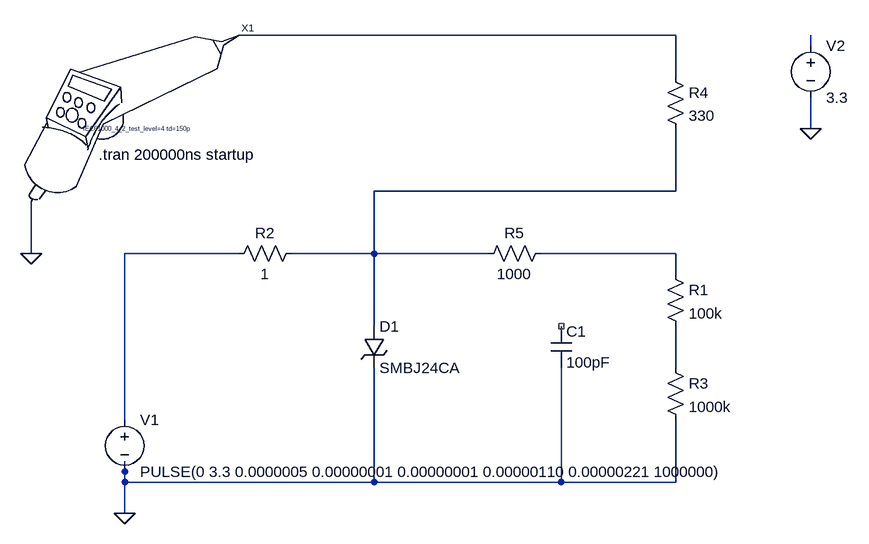
[diagram p0: schematic ESD验证.asc]
ESD验证.asc, the LTspice schematic file:
Version 4.1
SHEET 1 1248 852
WIRE 976 64 304 64
WIRE 1184 80 1184 64
WIRE 976 128 976 64
WIRE 1184 208 1184 160
WIRE 976 304 976 208
WIRE 976 304 512 304
WIRE -16 400 -16 320
WIRE 304 400 128 400
WIRE 512 400 512 304
WIRE 512 400 384 400
WIRE 688 400 512 400
WIRE 976 400 768 400
WIRE 976 432 976 400
WIRE 512 512 512 400
WIRE 976 576 976 512
WIRE 128 656 128 400
WIRE 128 736 128 720
WIRE 128 752 128 736
WIRE 512 752 512 576
WIRE 512 752 128 752
WIRE 800 752 800 576
WIRE 800 752 512 752
WIRE 976 752 976 656
WIRE 976 752 800 752
WIRE 128 800 128 752
FLAG -16 400 0
FLAG 128 800 0
FLAG 1184 208 0
SYMBOL ESD模型\\1818be98-41c7-4d63-a15d-34b865506851\\IEC61000-4-2_ESD_Generator 64 208 R0
WINDOW 39 0 0 Left 0
SYMATTR SpiceLine IEC61000_4_2_test_level=4 td=150p
SYMATTR InstName X1
SYMBOL voltage 128 640 R0
WINDOW 123 0 0 Left 0
WINDOW 39 0 0 Left 0
SYMATTR InstName V1
SYMATTR Value PULSE(0 3.3 0.0000005 0.00000001 0.00000001 0.00000110 0.00000221 1000000)
SYMBOL res 400 384 R90
WINDOW 0 0 56 VBottom 2
WINDOW 3 32 56 VTop 2
SYMATTR InstName R2
SYMATTR Value 1
SYMBOL res 960 560 R0
SYMATTR InstName R3
SYMATTR Value 1000k
SYMBOL res 960 112 R0
SYMATTR InstName R4
SYMATTR Value 330
SYMBOL res 960 416 R0
SYMATTR InstName R1
SYMATTR Value 100k
SYMBOL voltage 1184 64 R0
WINDOW 123 0 0 Left 0
WINDOW 39 0 0 Left 0
SYMATTR InstName V2
SYMATTR Value 3.3
SYMBOL TVSdiode 496 512 R0
WINDOW 0 24 0 Left 2
WINDOW 3 24 64 Left 2
SYMATTR InstName D1
SYMATTR Value SMBJ24CA
SYMATTR Description Diode
SYMATTR Type diode
SYMBOL cap 784 512 R0
SYMATTR InstName C1
SYMATTR Value 100pF
SYMBOL res 784 384 R90
WINDOW 0 0 56 VBottom 2
WINDOW 3 32 56 VTop 2
SYMATTR InstName R5
SYMATTR Value 1000
TEXT 88 248 Left 2 !.tran 200000ns startup

The netlist it stands for:
* ESD验证.asc
X§X1 N001 0 IEC61000-4-2_ESD_Generator params: IEC61000_4_2_test_level=4 td=150p  ; pins ESD GND
V1 N004 0 PULSE(0 3.3 0.0000005 0.00000001 0.00000001 0.00000110 0.00000221 1000000)
R2 N003 N004 1
R3 N006 0 1000k
R4 N001 N003 330
R1 N005 N006 100k
V2 N002 0 3.3
D1 N003 0 SMBJ24CA
C1 NC_01 0 100pF
R5 N005 N003 1000
.model D D
.lib standard.dio
.tran 200000ns startup
.backanno
.end